# Altium schematic sheet llrf_fm_extension_main.SchDoc: =GlobalProjectName
size 209 x 297 mm; SheetNumber: 1; SheetTotal: 3; PageSetup: Record=PageOptions|CenterHorizontal=True|CenterVertical=True|PrintScale=1.00|XCorrection=1.00|YCorrection=1.00|PrintKind=1|BorderSize=5000000|LeftOffset=0|BottomOffset=0|Orientation=2|PaperLength=1000|PaperWidth=1000|Scale=100|PaperSource=15|PrintQuality=1200|MediaType=1|DitherType=10|PaperKind=A3|PrintScaleMode=1; Weight: -; ScaleFactor: -
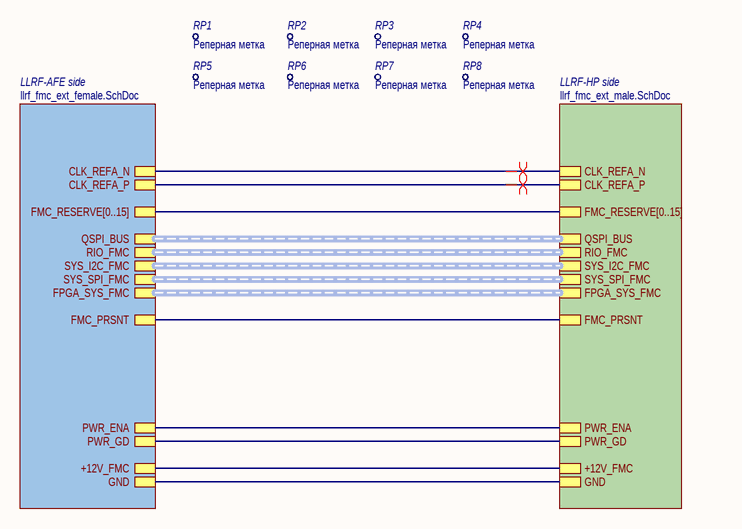
[diagram p0: llrf_fm_extension_main.SchDoc]

## Parts
RP1  Наименование: Реперная метка  [ReperPoint]  (hidden comment: RP)
RP2  Наименование: Реперная метка  [ReperPoint]  (hidden comment: RP)
RP3  Наименование: Реперная метка  [ReperPoint]  (hidden comment: RP)
RP4  Наименование: Реперная метка  [ReperPoint]  (hidden comment: RP)
RP5  Наименование: Реперная метка  [ReperPoint]  (hidden comment: RP)
RP6  Наименование: Реперная метка  [ReperPoint]  (hidden comment: RP)
RP7  Наименование: Реперная метка  [ReperPoint]  (hidden comment: RP)
RP8  Наименование: Реперная метка  [ReperPoint]  (hidden comment: RP)

## Sub-sheets
LLRF-AFE side = llrf_fmc_ext_female.SchDoc: PWR_ENA, FPGA_SYS_FMC (harness FPGA_SYS_FMC), FMC_PRSNT, CLK_REFA_N, CLK_REFA_P, GND, FMC_RESERVE[0..15], +12V_FMC, QSPI_BUS (harness QSPI_BUS), RIO_FMC (harness RIO_FMC), SYS_I2C_FMC (harness SYS_I2C_FMC), SYS_SPI_FMC (harness SYS_SPI_FMC), PWR_GD
LLRF-HP side = llrf_fmc_ext_male.SchDoc: PWR_ENA, FMC_PRSNT, CLK_REFA_N, CLK_REFA_P, GND, +12V_FMC, QSPI_BUS (harness QSPI_BUS), RIO_FMC (harness RIO_FMC), SYS_I2C_FMC (harness SYS_I2C_FMC), SYS_SPI_FMC (harness SYS_SPI_FMC), FMC_RESERVE[0..15], FPGA_SYS_FMC (harness FPGA_SYS_FMC), PWR_GD

## Nets
(unnamed): sheet LLRF-AFE side/PWR_ENA, sheet LLRF-HP side/PWR_ENA
(unnamed): sheet LLRF-AFE side/FMC_PRSNT, sheet LLRF-HP side/FMC_PRSNT
(unnamed): sheet LLRF-AFE side/CLK_REFA_N, sheet LLRF-HP side/CLK_REFA_N
(unnamed): sheet LLRF-AFE side/CLK_REFA_P, sheet LLRF-HP side/CLK_REFA_P
(unnamed): sheet LLRF-AFE side/GND, sheet LLRF-HP side/GND
(unnamed): sheet LLRF-AFE side/+12V_FMC, sheet LLRF-HP side/+12V_FMC
(unnamed): sheet LLRF-AFE side/PWR_GD, sheet LLRF-HP side/PWR_GD

## Buses and harness runs
bus sheet LLRF-AFE side/FMC_RESERVE[0..15] = sheet LLRF-HP side/FMC_RESERVE[0..15]
harness sheet LLRF-AFE side/FPGA_SYS_FMC = sheet LLRF-HP side/FPGA_SYS_FMC
harness sheet LLRF-AFE side/QSPI_BUS = sheet LLRF-HP side/QSPI_BUS
harness sheet LLRF-AFE side/RIO_FMC = sheet LLRF-HP side/RIO_FMC
harness sheet LLRF-AFE side/SYS_I2C_FMC = sheet LLRF-HP side/SYS_I2C_FMC
harness sheet LLRF-AFE side/SYS_SPI_FMC = sheet LLRF-HP side/SYS_SPI_FMC

## Layout directives
differential pair: (no net found under the mark)

## Notes on the sheet
- Перв. примен.
- Справ. №
- Подп. и дата
- Инв. № дубл.
- Взам. инв. №
- Разраб.
- Изм.
- Лист
- № докум.
- Подп.
- Дата
- Литера
- Масса
- Масштаб
- Пров.
- Т.контр.
- Листов
- Инв. № подл.
- Н.контр.
- Утв.
- Форма 1 ГОСТ 2.104-2006
- Копировал
- Формат А4

## Library data of the parts
RP1-RP8 = RP: Назначение: реперная метка для автоматического монтажа